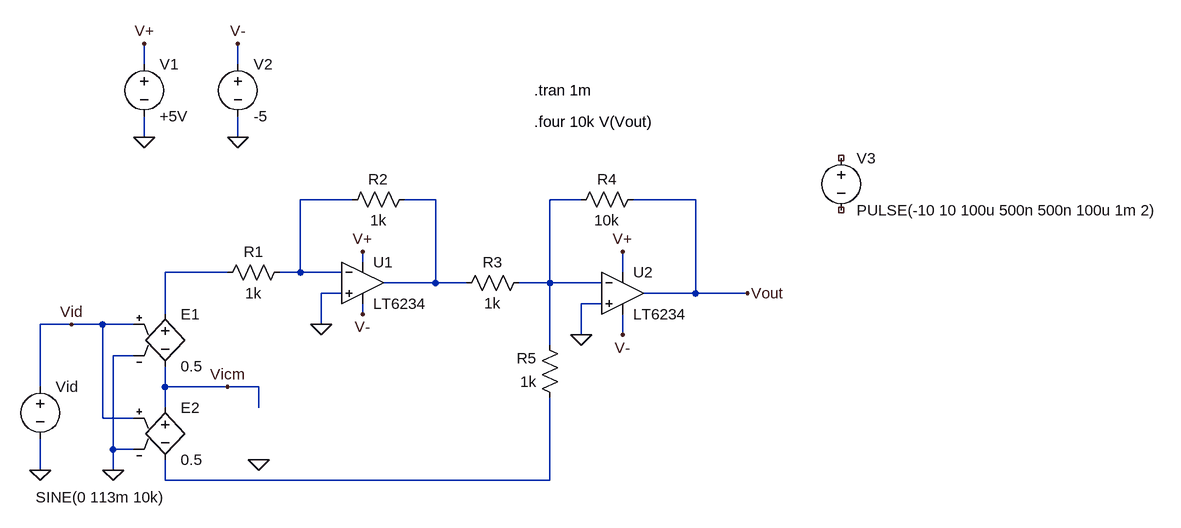
[diagram p0: schematic ETAJUL1_AI_TRANS.asc]
ETAJUL1_AI_TRANS.asc, the LTspice schematic file:
Version 4
SHEET 1 2624 680
WIRE -432 -160 -432 -192
WIRE -288 -160 -288 -192
WIRE -432 -48 -432 -80
WIRE -288 -48 -288 -80
WIRE -112 48 -192 48
WIRE 16 48 -32 48
WIRE 240 48 192 48
WIRE 416 48 320 48
WIRE -96 144 -96 128
WIRE -304 160 -400 160
WIRE -192 160 -192 48
WIRE -192 160 -224 160
WIRE -128 160 -192 160
WIRE 304 160 304 128
WIRE 16 176 16 48
WIRE 16 176 -64 176
WIRE 64 176 16 176
WIRE 192 176 192 48
WIRE 192 176 144 176
WIRE 272 176 192 176
WIRE -128 192 -160 192
WIRE 416 192 416 48
WIRE 416 192 336 192
WIRE 496 192 416 192
WIRE 272 208 240 208
WIRE -400 224 -400 160
WIRE -96 224 -96 208
WIRE -544 240 -592 240
WIRE -496 240 -544 240
WIRE -448 240 -496 240
WIRE -160 240 -160 192
WIRE 240 256 240 208
WIRE 304 256 304 224
WIRE 192 272 192 176
WIRE -448 288 -480 288
WIRE -592 336 -592 240
WIRE -400 336 -400 304
WIRE -304 336 -400 336
WIRE -256 336 -304 336
WIRE -400 368 -400 336
WIRE -256 368 -256 336
WIRE -496 384 -496 240
WIRE -448 384 -496 384
WIRE -480 432 -480 288
WIRE -448 432 -480 432
WIRE -592 464 -592 416
WIRE -480 464 -480 432
WIRE -400 480 -400 448
WIRE 192 480 192 352
WIRE 192 480 -400 480
FLAG 240 256 0
FLAG -160 240 0
FLAG -592 464 0
FLAG -256 448 0
FLAG -480 464 0
FLAG -432 -48 0
FLAG -288 -48 0
FLAG -96 128 V+
FLAG -432 -192 V+
FLAG 304 128 V+
FLAG -288 -192 V-
FLAG -96 224 V-
FLAG 304 256 V-
FLAG 496 192 Vout
FLAG -544 240 Vid
FLAG -304 336 Vicm
SYMBOL OpAmps\\LT6234 -96 176 R0
SYMATTR InstName U1
SYMBOL OpAmps\\LT6234 304 192 R0
SYMATTR InstName U2
SYMBOL res -16 32 R90
WINDOW 0 0 56 VBottom 2
WINDOW 3 32 56 VTop 2
SYMATTR InstName R2
SYMATTR Value 1k
SYMBOL res 336 32 R90
WINDOW 0 0 56 VBottom 2
WINDOW 3 32 56 VTop 2
SYMATTR InstName R4
SYMATTR Value 10k
SYMBOL res 208 368 R180
WINDOW 0 36 76 Left 2
WINDOW 3 36 40 Left 2
SYMATTR InstName R5
SYMATTR Value 1k
SYMBOL res -320 176 R270
WINDOW 0 32 56 VTop 2
WINDOW 3 0 56 VBottom 2
SYMATTR InstName R1
SYMATTR Value 1k
SYMBOL res 160 160 R90
WINDOW 0 0 56 VBottom 2
WINDOW 3 32 56 VTop 2
SYMATTR InstName R3
SYMATTR Value 1k
SYMBOL voltage -432 -176 R0
SYMATTR InstName V1
SYMATTR Value +5V
SYMBOL voltage -288 -176 R0
SYMATTR InstName V2
SYMATTR Value -5
SYMBOL voltage -592 320 R0
WINDOW 3 -7 186 Left 2
SYMATTR Value SINE(0 113m 10k)
SYMATTR InstName Vid
SYMBOL e -400 208 R0
SYMATTR InstName E1
SYMATTR Value 0.5
SYMBOL e -400 352 R0
SYMATTR InstName E2
SYMATTR Value 0.5
SYMBOL voltage 640 -32 R0
SYMATTR InstName V3
SYMATTR Value PULSE(-10 10 100u 500n 500n 100u 1m 2)
TEXT 168 -120 Left 2 !.tran 1m
TEXT 168 -72 Left 2 !.four 10k V(Vout)

The netlist it stands for:
* ETAJUL1_AI_TRANS.asc
* U1: LT6234 (symbol OpAmps\LT6234 not available, pins judged from their places): In+=0 In-=N001 V+=V+ V-=V- OUT=N002
* U2: LT6234 (symbol OpAmps\LT6234 not available, pins judged from their places): In+=0 In-=N003 V+=V+ V-=V- OUT=Vout
R2 N002 N001 1k
R4 Vout N003 10k
R5 N005 N003 1k
R1 N004 N001 1k
R3 N003 N002 1k
V1 V+ 0 +5V
V2 V- 0 -5
Vid Vid 0 SINE(0 113m 10k)
E1 N004 Vicm Vid 0 0.5
E2 Vicm N005 Vid 0 0.5
V3 NC_01 NC_02 PULSE(-10 10 100u 500n 500n 100u 1m 2)
.tran 1m
.four 10k V(Vout)
.backanno
.end